# Altium project multisheet create compound.PrjPcb
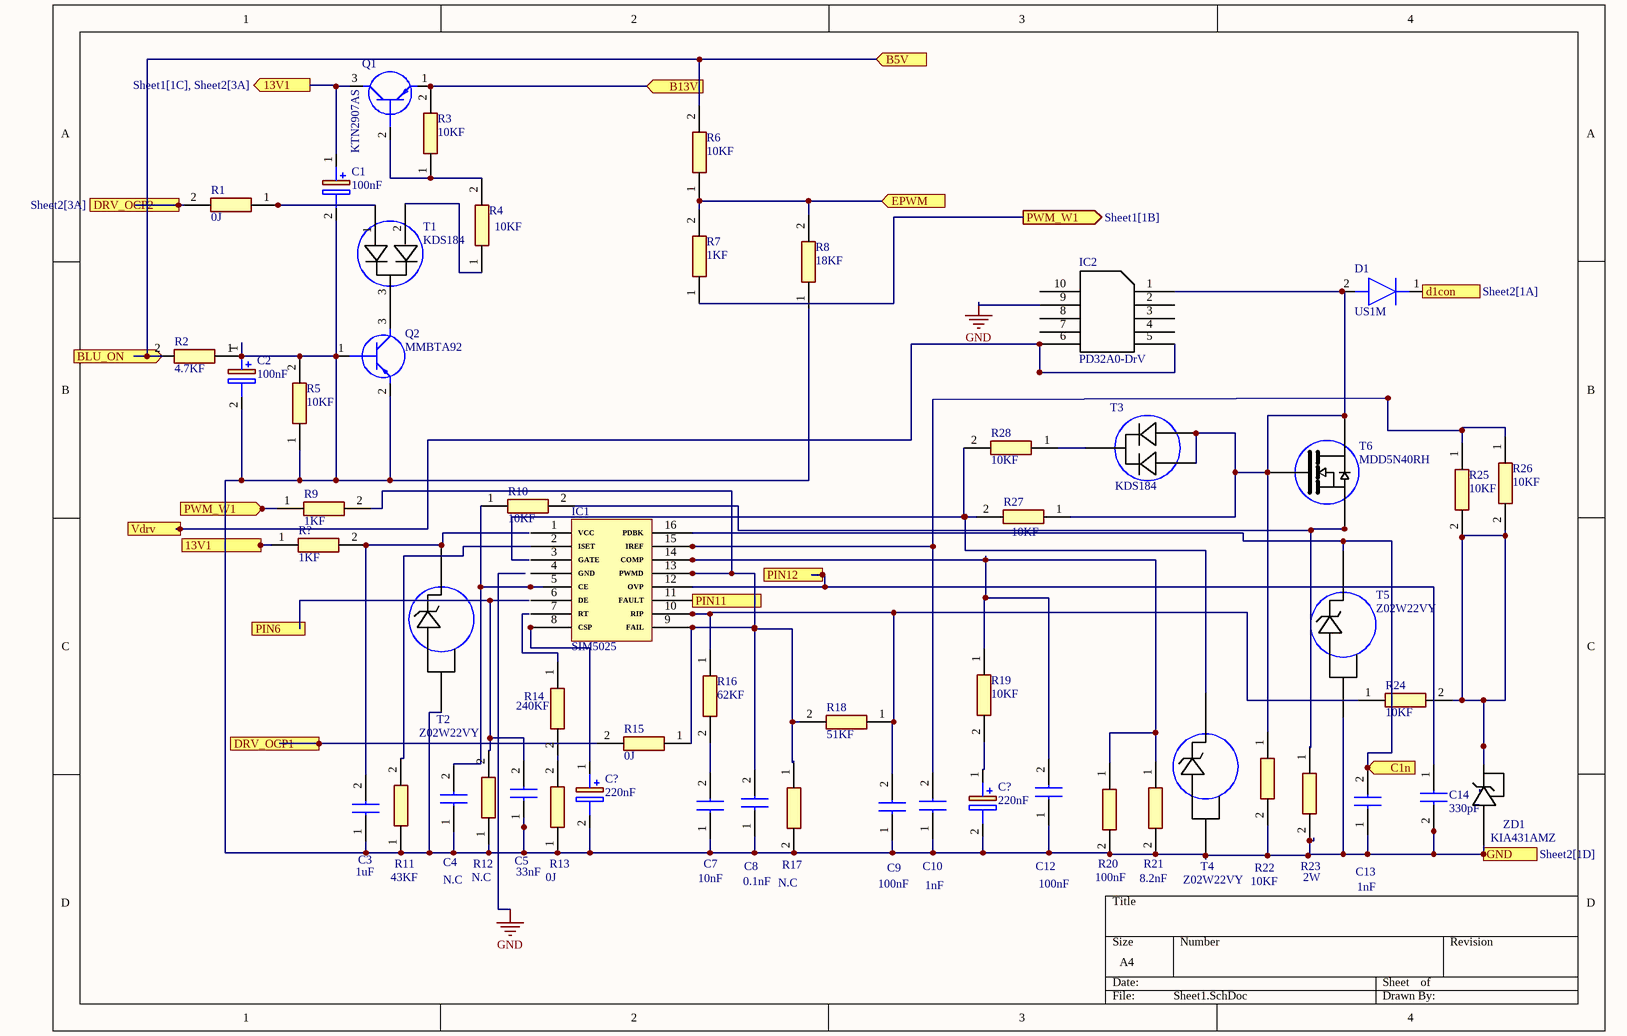
[diagram p0: Sheet1.SchDoc]
4 sheets, 174 parts. Net scope: flat (ports and power ports of the same name join across sheets).
Board file: PCB1.PcbDoc
Sheets:
  Sheet1.SchDoc
  Sheet2.SchDoc
  Sheet3.SchDoc
  Sheet4.SchDoc

## Sheet Sheet1.SchDoc
size A4; SheetNumber: 1; SheetTotal: 2

### Parts
(Parts that share a designator on the sheet are numbered #1, #2 ... from top to bottom, then left to right.)
C1  100nF  [CAPPRD150W50D400H600]
C2  100nF  [CAPPRD150W50D400H600]
C3  1uF  [CAPPRD200W55D525H1200]
C4  N.C  [CAPPRD200W55D525H1200]
C5  33nF  [CAPPRD200W55D525H1200]
C7  10nF  [CAPPRD200W55D525H1200]
C8  0.1nF  [CAPPRD200W55D525H1200]
C9  100nF  [CAPPRD200W55D525H1200]
C10  1nF  [CAPPRD200W55D525H1200]
C12  100nF  [CAPPRD200W55D525H1200]
C13  1nF  [CAPPRD200W55D525H1200]
C14  330pF  [FA18]
C?#1  220nF  [CAPPRD200W55D500H1250]
C?#2  220nF  [CAPPRD200W55D500H1250]
D1  US1M  [DIOM5127X229N]
IC1  SIM5025
IC2  PD32A0-DrV
Q1  KTN2907AS  [SOT95P245X130-3N]
Q2  MMBTA92  [SOT95P245X130-3N]
R1  0J  [RESAD1170W45L370D200]
R2  4.7KF  [RESAD1170W45L370D200]
R3  10KF  [RESAD1170W45L370D200]
R4  10KF  [RESAD1170W45L370D200]
R5  10KF  [RESAD1170W45L370D200]
R6  10KF  [RESAD1170W45L370D200]
R7  1KF  [RESAD1170W45L370D200]
R8  18KF  [RESAD1170W45L370D200]
R9  1KF  [RESAD1170W45L370D200]
R10  10KF  [RESAD1170W45L370D200]
R11  43KF  [RESAD1170W45L370D200]
R12  N.C  [RESAD1170W45L370D200]
R13  0J  [RESAD1170W45L370D200]
R14  240KF  [RESAD1170W45L370D200]
R15  0J  [RESAD1170W45L370D200]
R16  62KF  [RESAD1170W45L370D200]
R17  N.C  [RESAD1170W45L370D200]
R18  51KF  [RESAD1170W45L370D200]
R19  10KF  [RESAD1170W45L370D200]
R20  100nF  [RESAD1170W45L370D200]
R21  8.2nF  [RESAD1170W45L370D200]
R22  10KF  [RESAD1170W45L370D200]
R23  2W  [RESAD1170W45L370D200]
R24  10KF  [RESAD1170W45L370D200]
R25  10KF  [RESAD1170W45L370D200]
R26  10KF  [RESAD1170W45L370D200]
R27  10KF  [RESAD1170W45L370D200]
R28  10KF  [RESAD1170W45L370D200]
R?  1KF  [RESAD1170W45L370D200]
T1  KDS184
T2  Z02W22VY
T3  KDS184
T4  Z02W22VY
T5  Z02W22VY
T6  MDD5N40RH
ZD1  KIA431AMZ

### Ports
13V1 (in, see Sheet1[1A], Sheet2[3A]), 13V1 (out, see Sheet1[1C], Sheet2[3A]), B5V (in), B13V (in), BLU_ON (in), C1n (in, see Sheet2[2C]), d1con (in, see Sheet2[1A]), DRV_OCP1 (out), DRV_OCP2 (in, see Sheet2[3A]), EPWM (in), GND (in, see Sheet2[1D]), PIN6 (in, see Sheet2[3D]), PIN11 (in, see Sheet2[2C]), PIN12 (in, see Sheet2[1C]), PWM_W1 (in, see Sheet1[3A]), PWM_W1 (out, see Sheet1[1B]), Vdrv (in)

### Nets
GND: C1.2(-) C2.1(+) C2.2(-) C3.1(+) C4.1(+) C5.1(+) C7.1(+) C8.1(+) C9.1(+) C10.1(+) C12.1(+) C13.1(+) C14.2 C?#1.2(-) C?#2.2(-) IC2.9 Q2.1(B) Q2.2(E) R2.1 R5.1 R5.2 R8.1 R11.1 R12.1 R13.1 R17.2 R20.2 R21.2 R22.2 R23.2 T2.2 T4.2 T5.2 ZD1.66 ; port GND
NetC1_1: C1.1(+) Q1.3(C) R?.1 ; port 13V1
NetC3_2: C3.2(-) R?.2 T2.1
NetC4_2: C4.2(-) IC1.5(CE) R10.1
NetC5_2: C5.2(-) R12.2
NetC7_2: C7.2(-) R16.2
NetC8_2: C8.2(-) IC1.9(FAIL) IC1.13(PWMD) R9.2 R15.1 R17.1 R18.2
NetC9_2: C9.2(-) IC1.10(RIP) R16.1 R18.1 R24.1
NetC10_2: C10.2(-) IC1.15(IREF) R25.1 R26.1
NetC12_2: C12.2(-) IC1.14(COMP) R19.1 R20.1 R21.1
NetC13_2: C13.2(-) IC1.16(PDBK) T5.1 ; port C1n
NetC14_1: C14.1 IC1.12(OVP) ; port PIN12
NetC15_2: D1.1(K) ; port d1con
NetC40_2: R2.2 R6.2 ; port BLU_ON, port B5V
NetC?#1_1: C?#1.1(+) IC1.8(CSP)
NetC?#2_1: C?#2.1(+) R19.2
NetD1_2: D1.2(A) IC2.1 R22.1 R27.1 T3.1 T3.2 T6.70 T6.72
NetD21_2: R15.2 ; port DRV_OCP1
NetD22_2: R1.2 ; port DRV_OCP2
NetIC1_2: IC1.2(ISET) R11.2
NetIC1_11: IC1.11(FAULT) ; port PIN11
NetIC2_5: IC2.5 IC2.6 ; port Vdrv
NetIC5_2: R6.1 R7.2 R8.2 ; port EPWM
NetQ1_1: Q1.1(E) R3.2 ; port B13V
NetQ1_2: Q1.2(B) R3.1 R4.2
NetQ2_3: Q2.3(C) T1.3
NetR1_1: R1.1 T1.1
NetR4_1: R4.1 T1.2
NetR7_1: R7.1 R9.1 ; port PWM_W1
NetR10_2: R10.2 R23.1 T6.71
NetR13_2: R13.2 R14.2
NetR24_2: R24.2 R25.2 R26.2 ZD1.67
NetR27_2: R27.2 R28.2 T4.1
NetR28_1: R28.1 T3.3

Not connected (* = marked no-connect by the designer): IC1 1(VCC) 3(GATE) 4(GND) 6(DE) 7(RT); IC2 2(55) 3(56) 4(57) 7(62) 8(61) 10(59); R14 1

### Library data of the parts
C1 C2 = ECEA1HKS0R1: Capacitor Polarised; Manufacturer_Name: Panasonic; Datasheet Link: https://componentsearchengine.com/Datasheets/2/ECEA1HKS0R1.pdf; Height: 6mm; Manufacturer_Part_Number: ECEA1HKS0R1
C3-C5 C7-C10 C12 C13 = ECA-1HM0R1: Capacitor; Manufacturer_Name: Panasonic; Height: 12mm; Manufacturer_Part_Number: ECA-1HM0R1; Mouser Part Number: 667-ECA-1HM0R1; Mouser Price/Stock: https://www.mouser.com/Search/Refine.aspx?Keyword=667-ECA-1HM0R1
C14 = FA18C0G1H331JNU06: Capacitor; Manufacturer_Name: TDK; Datasheet Link: https://product.tdk.com/system/files/dam/doc/product/capacitor/ceramic/lead-mlcc/catalog/leadmlcc_halogenfree_fa_en.pdf; Height: 5.5mm; Manufacturer_Part_Number: FA18C0G1H331JNU06; Mouser Part Number: 810-FA18C0G1H331JNU6; Mouser Price/Stock: https://www.mouser.com/Search/Refine.aspx?Keyword=810-FA18C0G1H331JNU6
C?#1 C?#2 = EEUHD1HR22: Capacitor Polarised; Manufacturer_Name: Panasonic; Datasheet Link: http://industrial.panasonic.com/cdbs/www-data/pdf/RDF0000/ABA0000C1035.pdf; Height: 12.5mm; Manufacturer_Part_Number: EEUHD1HR22
D1 = US1M-E3_61T: Diode; Manufacturer_Name: Vishay; Manufacturer_Part_Number: US1M-E3/61T; Datasheet Link: https://componentsearchengine.com/Datasheets/2/US1M-E3_61T.pdf; Height: 2.29mm; Mouser Part Number: 625-US1M-E3; Mouser Price/Stock: https://www.mouser.co.uk/ProductDetail/Vishay-General-Semiconductor/US1M-E3-61T?qs=D6r9GjgEnNOosWuyVR8q1A%3D%3D; Arrow Part Number: US1M-E3/61T; Arrow Price/Stock: https://www.arrow.com/en/products/us1m-e361t/vishay?region=europe
Q1 = KTN2907AS: Transistor BJT PNP; Manufacturer_Name: KEC; Datasheet Link: https://4donline.ihs.com/images/VipMasterIC/IC/KECC/KECC-S-A0011628695/KECC-S-A0011628695-1.pdf?hkey=EF798316E3902B6ED9A73243A3159BB0; Height: 1.3mm; Manufacturer_Part_Number: KTN2907AS
Q2 = MMBTA92: Transistor BJT PNP; Manufacturer_Name: KEC; Datasheet Link: https://www.alldatasheet.com/datasheet-pdf/pdf/69996/KEC/MMBTA92.html; Height: 1.3mm; Manufacturer_Part_Number: MMBTA92
R1-R28 R? = MFR3-10KFC: Resistor; Manufacturer_Name: TT Electronics; Datasheet Link: https://componentsearchengine.com/Datasheets/2/MFR3-10KFC.pdf; Manufacturer_Part_Number: MFR3-10KFC; Mouser Part Number: 756-MFR3-10KFC; Mouser Price/Stock: https://www.mouser.co.uk/ProductDetail/Welwyn-Components-TT-Electronics/MFR3-10KFC?qs=i9QNUsDsAPN%252BMi4lKUEV5Q%3D%3D; Arrow Part Number: MFR3-10KFC; Arrow Price/Stock: https://www.arrow.com/en/products/mfr3-10kfc/welwyn-components?region=europe

## Sheet Sheet2.SchDoc
size A4; SheetNumber: 2; SheetTotal: 2
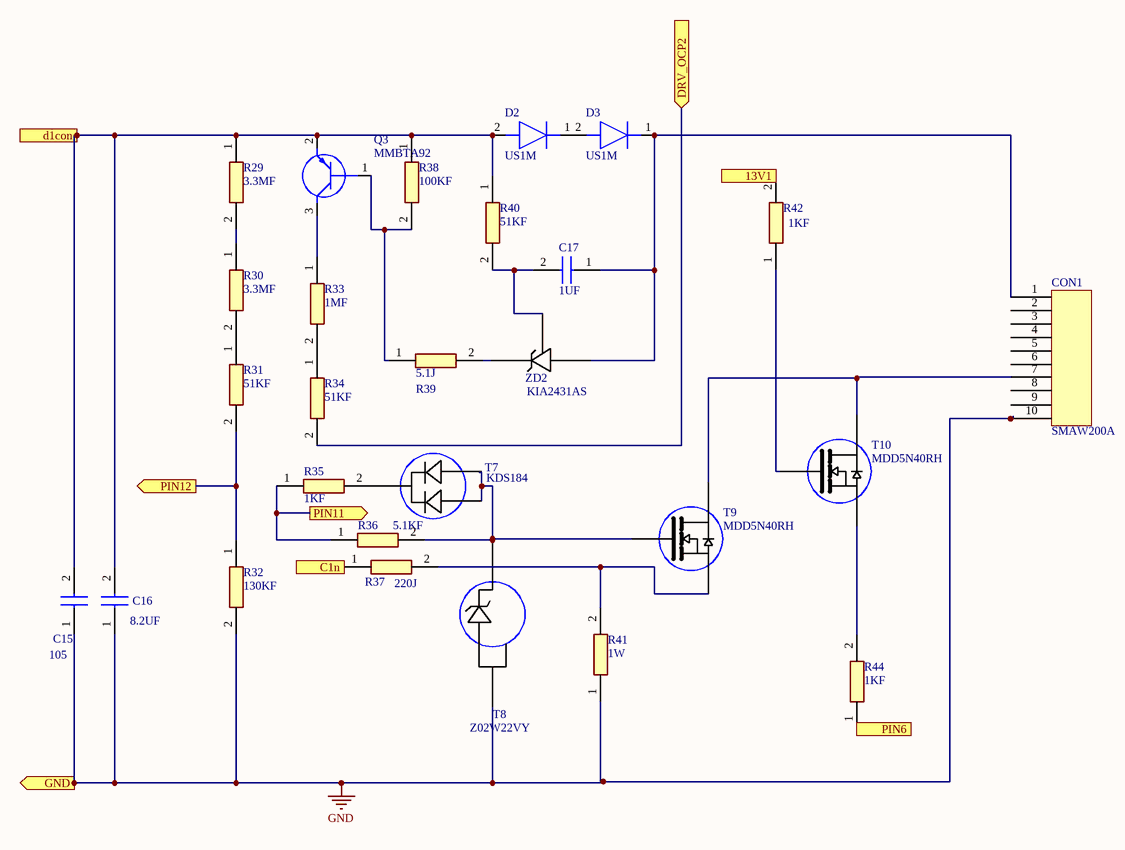
[diagram p1: Sheet2.SchDoc]

### Parts
C15  105  [CAPPRD200W55D525H1200]
C16  8.2UF  [CAPPRD200W55D525H1200]
C17  1UF  [CAPPRD200W55D525H1200]
CON1  SMAW200A  [SMAW200A]
D2  US1M  [DIOM5127X229N]
D3  US1M  [DIOM5127X229N]
Q3  MMBTA92  [SOT95P245X130-3N]
R29  3.3MF  [RESAD1170W45L370D200]
R30  3.3MF  [RESAD1170W45L370D200]
R31  51KF  [RESAD1170W45L370D200]
R32  130KF  [RESAD1170W45L370D200]
R33  1MF  [RESAD1170W45L370D200]
R34  51KF  [RESAD1170W45L370D200]
R35  1KF  [RESAD1170W45L370D200]
R36  5.1KF  [RESAD1170W45L370D200]
R37  220J  [RESAD1170W45L370D200]
R38  100KF  [RESAD1170W45L370D200]
R39  5.1J  [RESAD1170W45L370D200]
R40  51KF  [RESAD1170W45L370D200]
R41  1W  [RESAD1170W45L370D200]
R42  1KF  [RESAD1170W45L370D200]
R44  1KF  [RESAD1170W45L370D200]
T7  KDS184
T8  Z02W22VY
T9  MDD5N40RH
T10  MDD5N40RH
ZD2  KIA2431AS  [KIA2431AS]

### Ports
13V1 (in, see Sheet1[1A], Sheet1[1C]), C1n (out, see Sheet1[4C]), d1con (out, see Sheet1[4B]), DRV_OCP2 (in, see Sheet1[1A]), GND (out, see Sheet1[4D]), PIN6 (out, see Sheet1[1C]), PIN11 (out, see Sheet1[2C]), PIN12 (out, see Sheet1[2C])

### Nets
GND: C15.1(+) C16.1(+) CON1.10 R32.2 R41.1 T8.2 ; port GND
NetC1_1: R42.2 ; port 13V1
NetC13_2: R37.1 ; port C1n
NetC14_1: R31.2 R32.1 ; port PIN12
NetC15_2: C15.2(-) C16.2(-) D2.2(A) Q3.2(E) R29.1 R38.1 R40.1 ; port d1con
NetC17_1: C17.1(+) CON1.1 D3.1(K) ZD2.2
NetC17_2: C17.2(-) R40.2 ZD2.3
NetCON1_7: CON1.7 T9.70 T10.70
NetD2_1: D2.1(K) D3.2(A)
NetD22_2: R34.2 ; port DRV_OCP2
NetIC1_11: R35.1 R36.1 ; port PIN11
NetQ3_1: Q3.1(B) R38.2 R39.1
NetQ3_3: Q3.3(C) R33.1
NetR29_2: R29.2 R30.1
NetR30_2: R30.2 R31.1
NetR33_2: R33.2 R34.1
NetR35_2: R35.2 T7.3
NetR36_2: R36.2 T7.2 T8.1 T9.72
NetR37_2: R37.2 R41.2 T9.71
NetR39_2: R39.2 ZD2.1
NetR42_1: R42.1 T10.72
NetR44_1: R44.1 ; port PIN6
NetR44_2: R44.2 T10.71

Not connected (* = marked no-connect by the designer): CON1 2(70) 3(71) 4(72) 5(73) 6(74) 8(76) 9(77); T7 1(25)

### Library data of the parts
C15-C17 = ECA-1HM0R1: Capacitor; Manufacturer_Name: Panasonic; Height: 12mm; Manufacturer_Part_Number: ECA-1HM0R1; Mouser Part Number: 667-ECA-1HM0R1; Mouser Price/Stock: https://www.mouser.com/Search/Refine.aspx?Keyword=667-ECA-1HM0R1
D2 D3 = US1M-E3_61T: as D1 on sheet Sheet1; Datasheet Link: https://componentsearchengine.com/Datasheets/2/US1M-E3_61T.pdf; Height: 2.29mm; Mouser Part Number: 625-US1M-E3; Mouser Price/Stock: https://www.mouser.co.uk/ProductDetail/Vishay-General-Semiconductor/US1M-E3-61T?qs=D6r9GjgEnNOosWuyVR8q1A%3D%3D; Arrow Part Number: US1M-E3/61T; Arrow Price/Stock: https://www.arrow.com/en/products/us1m-e361t/vishay?region=europe
Q3 = MMBTA92: as Q2 on sheet Sheet1; Datasheet Link: https://www.alldatasheet.com/datasheet-pdf/pdf/69996/KEC/MMBTA92.html; Height: 1.3mm; Manufacturer_Part_Number: MMBTA92
R29-R42 R44 = MFR3-10KFC: as R1 on sheet Sheet1; Datasheet Link: https://componentsearchengine.com/Datasheets/2/MFR3-10KFC.pdf; Manufacturer_Part_Number: MFR3-10KFC; Mouser Part Number: 756-MFR3-10KFC; Mouser Price/Stock: https://www.mouser.co.uk/ProductDetail/Welwyn-Components-TT-Electronics/MFR3-10KFC?qs=i9QNUsDsAPN%252BMi4lKUEV5Q%3D%3D; Arrow Part Number: MFR3-10KFC; Arrow Price/Stock: https://www.arrow.com/en/products/mfr3-10kfc/welwyn-components?region=europe

## Sheet Sheet3.SchDoc
size A4; SheetNumber: 3; SheetTotal: 3
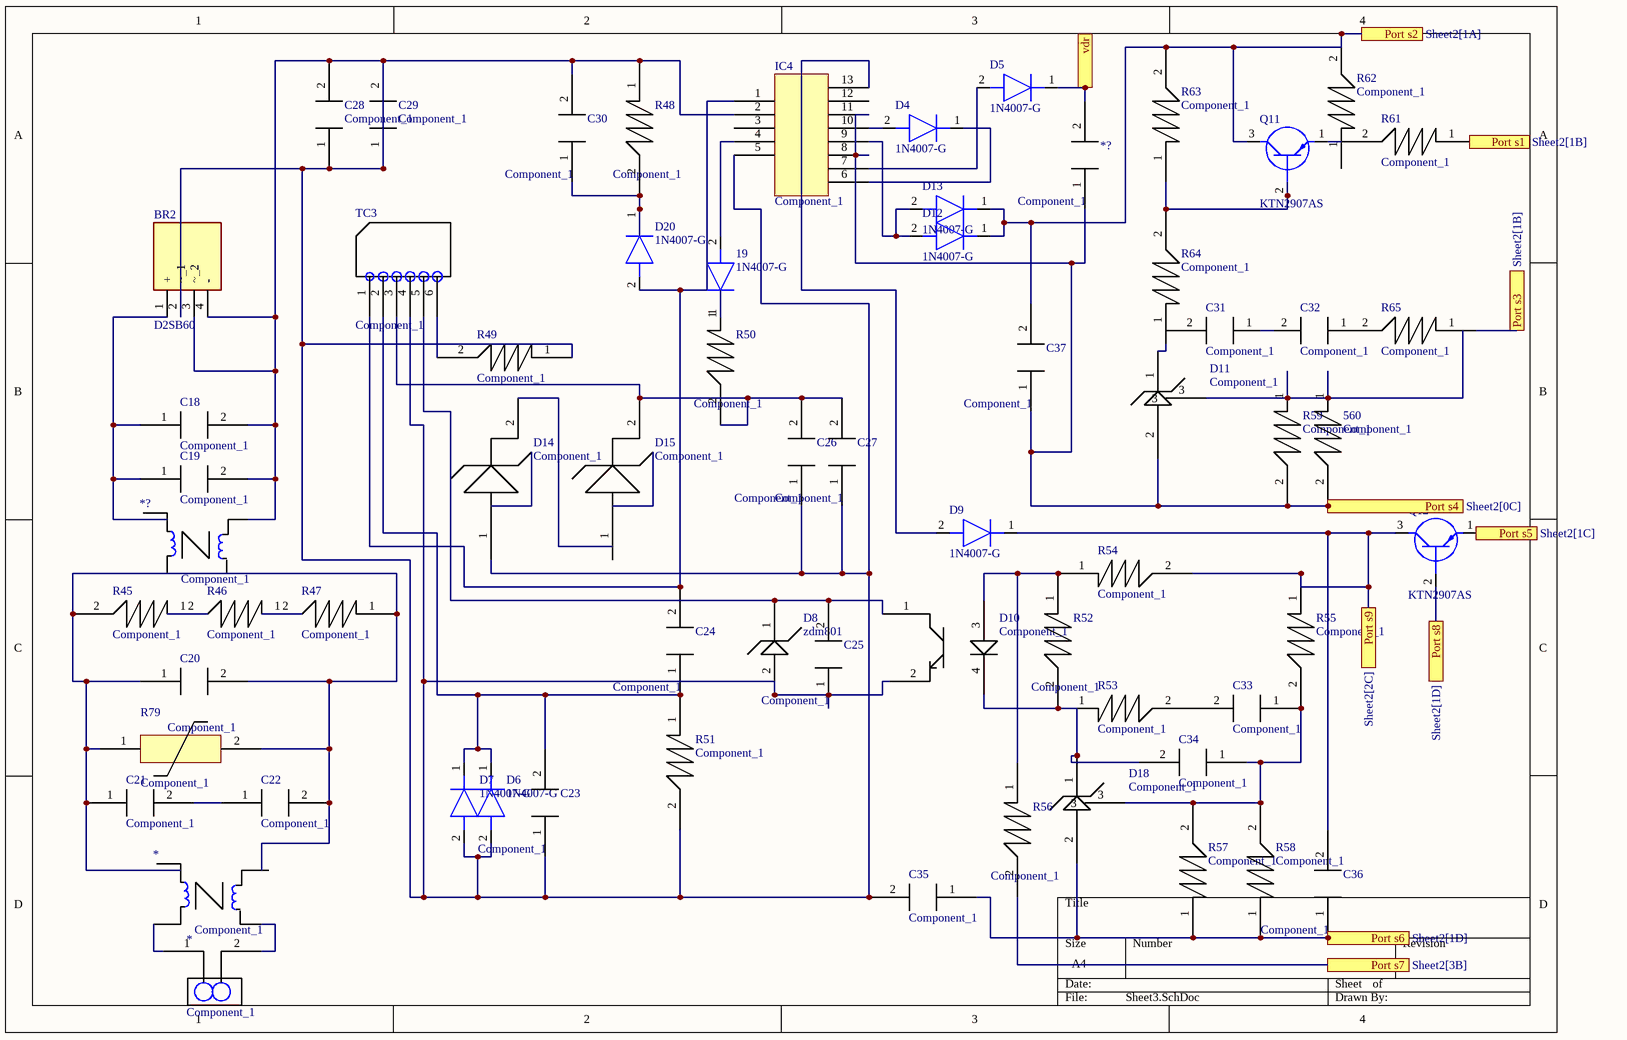
[diagram p2: Sheet3.SchDoc]

### Parts
(Parts that share a designator on the sheet are numbered #1, #2 ... from top to bottom, then left to right.)
19  1N4007-G  [DIOAD1410W90L470D235]
560  Component_1  [PCBComponent_1]
*#1  Component_1  [PCBComponent_1]
*#2  Component_1  [PCBComponent_1]
*?#1  Component_1  [PCBComponent_1]
*?#2  Component_1  [PCBComponent_1]
BR2  D2SB60  [D2SB60]
C18  Component_1  [PCBComponent_1]
C19  Component_1  [PCBComponent_1]
C20  Component_1  [PCBComponent_1]
C21  Component_1  [PCBComponent_1]
C22  Component_1  [PCBComponent_1]
C23  Component_1  [PCBComponent_1]
C24  Component_1  [PCBComponent_1]
C25  Component_1  [PCBComponent_1]
C26  Component_1  [PCBComponent_1]
C27  Component_1  [PCBComponent_1]
C28  Component_1  [PCBComponent_1]
C29  Component_1  [PCBComponent_1]
C30  Component_1  [PCBComponent_1]
C31  Component_1  [PCBComponent_1]
C32  Component_1  [PCBComponent_1]
C33  Component_1  [PCBComponent_1]
C34  Component_1  [PCBComponent_1]
C35  Component_1  [PCBComponent_1]
C36  Component_1  [PCBComponent_1]
C37  Component_1  [PCBComponent_1]
D4  1N4007-G  [DIOAD1410W90L470D235]
D5  1N4007-G  [DIOAD1410W90L470D235]
D6  1N4007-G  [DIOAD1410W90L470D235]
D7  1N4007-G  [DIOAD1410W90L470D235]
D8  zdm801  [PCBComponent_1]
D9  1N4007-G  [DIOAD1410W90L470D235]
D10  Component_1  [PCBComponent_1]
D11  Component_1  [PCBComponent_1]
D12  1N4007-G  [DIOAD1410W90L470D235]
D13  1N4007-G  [DIOAD1410W90L470D235]
D14  Component_1
D15  Component_1
D18#1  Component_1  [PCBComponent_1]
D20  1N4007-G  [DIOAD1410W90L470D235]
IC4  Component_1  [PCBComponent_1]
Q11  KTN2907AS  [SOT95P245X130-3N]
Q12  KTN2907AS  [SOT95P245X130-3N]
R45  Component_1  [PCBComponent_1]
R46  Component_1  [PCBComponent_1]
R47  Component_1  [PCBComponent_1]
R48  Component_1  [PCBComponent_1]
R49  Component_1  [PCBComponent_1]
R50  Component_1  [PCBComponent_1]
R51  Component_1  [PCBComponent_1]
R52  Component_1  [PCBComponent_1]
R53  Component_1  [PCBComponent_1]
R54  Component_1  [PCBComponent_1]
R55  Component_1  [PCBComponent_1]
R56  Component_1  [PCBComponent_1]
R57  Component_1  [PCBComponent_1]
R58  Component_1  [PCBComponent_1]
R59  Component_1  [PCBComponent_1]
R61  Component_1  [PCBComponent_1]
R62  Component_1  [PCBComponent_1]
R63  Component_1  [PCBComponent_1]
R64  Component_1  [PCBComponent_1]
R65  Component_1  [PCBComponent_1]
R79  Component_1
TC3  Component_1  [PCBComponent_1]

### Ports
Port s1 (see Sheet2[1B]), Port s2 (see Sheet2[1A]), Port s3 (see Sheet2[1B]), Port s4 (see Sheet2[0C]), Port s5 (see Sheet2[1C]), Port s6 (see Sheet2[1D]), Port s7 (see Sheet2[3B]), Port s8 (see Sheet2[1D]), Port s9 (see Sheet2[2C]), vdr

### Nets
Net19_1: 19.1(K) R50.1
Net19_2: 19.2(A) IC4.4
Net560_1: 560.1 D11.3 R59.1
Net560_2: 560.2 *?#1.1 C35.1 C36.1 C36.2 C37.1 D9.1(K) D11.2 D18#1.2 IC4.8 IC4.11 Q12.3(C) R54.2 R55.1 R57.1 R58.1 R59.2 ; port Port s4, port Port s6, port Port s9
Net*?#1_2: *?#1.2 D5.1(K) ; port vdr
Net*?#3_1: R65.1 ; port Port s3
NetBR2_1: BR2.1(+) C18.1 C19.1
NetBR2_2: BR2.2(~_1) BR2.3(~_2) BR2.4(-) C18.2 C19.2 C23.1 C25.1 C26.1 C27.1 C28.1 C28.2 C29.1 C29.2 C30.2 C35.2 D6.2(A) D7.2(A) D8.2 D10.2 D14.1 IC4.2 IC4.5 R48.1 R49.1 R51.2 TC3.4
NetC20_1: C20.1 C20.2 C21.1 C22.2 R45.2 R47.1 R79.1 R79.2
NetC21_2: C21.2 C22.1
NetC23_2: C23.2 C24.1 D6.1(K) D7.1(K) R51.1 TC3.2
NetC24_2: C24.2 D20.2(A) IC4.1 TC3.1
NetC25_2: C25.2 D8.1 D10.1 TC3.5
NetC26_2: C26.2 C27.2 D15.2 R50.2 TC3.3
NetC30_1: C30.1 D20.1(K) R48.2
NetC31_1: C31.1 C32.2
NetC33_1: C33.1 C34.1 D18#1.3 R55.2 R57.2 R58.2
NetC33_2: C33.2 R53.2
NetC34_2: C34.2 D10.4 D18#1.1 R52.2 R53.1
NetC37_2: C37.2 D12.1(K) D13.1(K) Q11.3(C) R62.2 R63.2 ; port Port s2
NetC40_2: Q12.1(E) ; port Port s5
NetD4_1: D4.1(K) IC4.6
NetD4_2: D4.2(A) IC4.10
NetD5_2: D5.2(A) IC4.7
NetD9_2: D9.2(A) IC4.13
NetD10_3: D10.3 R52.1 R54.1 R56.1
NetD11_1: D11.1 R64.1
NetD12_2: D12.2(A) D13.2(A) IC4.9
NetD18#2_2: Q12.2(B) ; port Port s8
NetQ11_1: Q11.1(E) R61.2
NetQ11_2: Q11.2(B) R63.1 R64.2
NetQ15_1: R56.2 ; port Port s7
NetR45_1: R45.1 R46.2
NetR46_1: R46.1 R47.2
NetR49_2: R49.2 TC3.6

Not connected (* = marked no-connect by the designer): *#1 1 2; C31 2; C32 1; D14 2; D15 1; IC4 3 12; R61 1; R62 1; R65 2

### Library data of the parts
19 D4-D7 D9 D12 D13 D20 = 1N4007-G: Diode; Manufacturer_Name: Comchip Technology; Datasheet Link: https://datasheet.datasheetarchive.com/originals/distributors/Datasheets-DGA23/1390217.pdf; Manufacturer_Part_Number: 1N4007-G; Mouser Part Number: 750-1N4007-G; Mouser Price/Stock: https://www.mouser.co.uk/ProductDetail/Comchip-Technology/1N4007-G?qs=2qJf6qQ4IOKzApuByvlhjQ%3D%3D; Arrow Part Number: 1N4007-G; Arrow Price/Stock: https://www.arrow.com/en/products/1n4007-g/comchip-technology?region=nac
BR2 = D2SB60: Bridge Rectifier; Manufacturer_Name: Taiwan Semiconductor; Datasheet Link: https://www.taiwansemi.com/assets/uploads/datasheet/D2SB05%20SERIES_K2103.pdf; Height: 11.3mm; Manufacturer_Part_Number: D2SB60; Mouser Part Number: 821-D2SB60; Mouser Price/Stock: https://www.mouser.com/Search/Refine.aspx?Keyword=821-D2SB60
Q11 Q12 = KTN2907AS: as Q1 on sheet Sheet1; Datasheet Link: https://4donline.ihs.com/images/VipMasterIC/IC/KECC/KECC-S-A0011628695/KECC-S-A0011628695-1.pdf?hkey=EF798316E3902B6ED9A73243A3159BB0; Height: 1.3mm; Manufacturer_Part_Number: KTN2907AS

## Sheet Sheet4.SchDoc
size A4; SheetNumber: 4; SheetTotal: 4
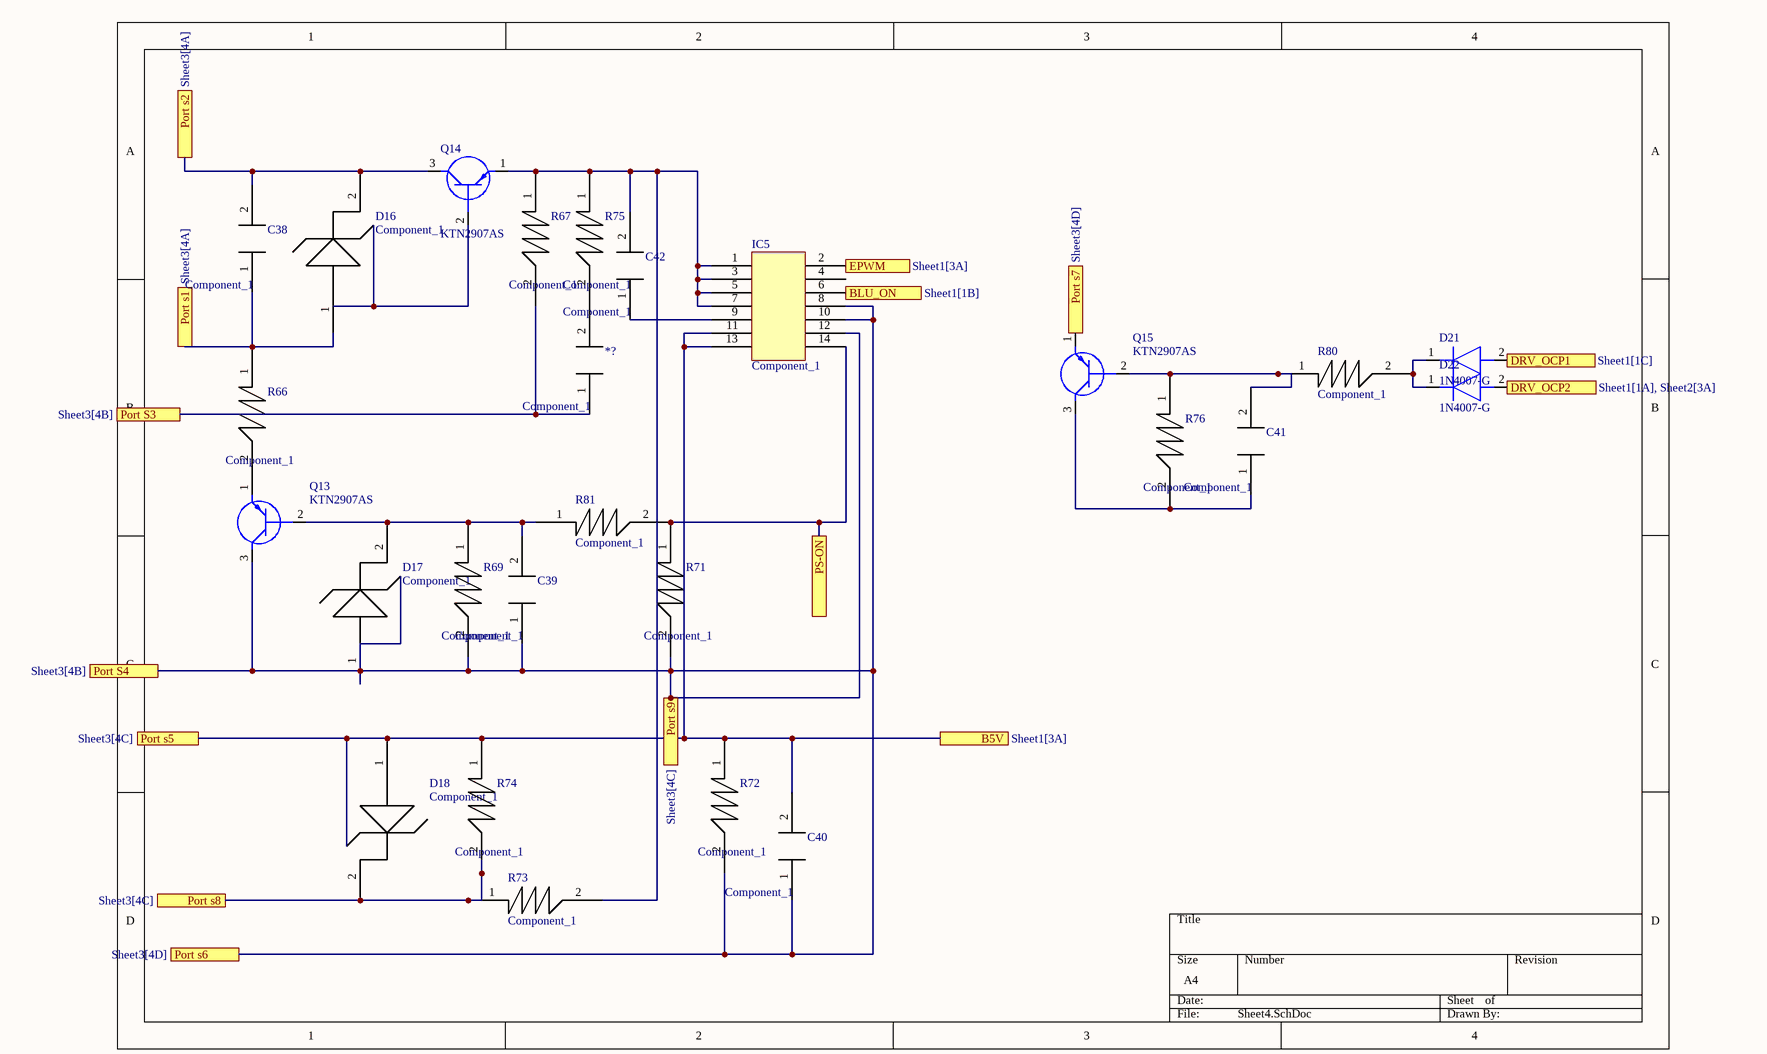
[diagram p3: Sheet4.SchDoc]

### Parts
(Parts that share a designator on the sheet are numbered #1, #2 ... from top to bottom, then left to right.)
*?#3  Component_1  [PCBComponent_1]
C38  Component_1  [PCBComponent_1]
C39  Component_1  [PCBComponent_1]
C40  Component_1  [PCBComponent_1]
C41  Component_1  [PCBComponent_1]
C42  Component_1  [PCBComponent_1]
D16  Component_1
D17  Component_1
D18#2  Component_1
D21  1N4007-G  [DIOAD1410W90L470D235]
D22  1N4007-G  [DIOAD1410W90L470D235]
IC5  Component_1  [PCBComponent_1]
Q13  KTN2907AS  [SOT95P245X130-3N]
Q14  KTN2907AS  [SOT95P245X130-3N]
Q15  KTN2907AS  [SOT95P245X130-3N]
R66  Component_1  [PCBComponent_1]
R67  Component_1  [PCBComponent_1]
R69  Component_1  [PCBComponent_1]
R71  Component_1  [PCBComponent_1]
R72  Component_1  [PCBComponent_1]
R73  Component_1  [PCBComponent_1]
R74  Component_1  [PCBComponent_1]
R75  Component_1  [PCBComponent_1]
R76  Component_1  [PCBComponent_1]
R80  Component_1  [PCBComponent_1]
R81  Component_1  [PCBComponent_1]

### Ports
B5V (see Sheet1[3A]), BLU_ON (see Sheet1[1B]), DRV_OCP1 (see Sheet1[1C]), DRV_OCP2 (see Sheet1[1A], Sheet2[3A]), EPWM (see Sheet1[3A]), Port s1 (see Sheet3[4A]), Port s2 (see Sheet3[4A]), Port S3 (see Sheet3[4B]), Port S4 (see Sheet3[4B]), Port s5 (see Sheet3[4C]), Port s6 (see Sheet3[4D]), Port s7 (see Sheet3[4D]), Port s8 (see Sheet3[4C]), Port s9 (see Sheet3[4C]), PS-ON

### Nets
Net560_2: C39.1 C40.1 D17.1 IC5.8 IC5.10 IC5.12 Q13.3(C) R69.2 R71.2 R72.2 ; port Port S4, port Port s9, port Port s6
Net*?#3_1: *?#3.1 R67.2 ; port Port S3
Net*?#3_2: *?#3.2 R75.2
NetC37_2: C38.2 D16.2 Q14.3(C) ; port Port s2
NetC38_1: C38.1 D16.1 R66.1 ; port Port s1
NetC39_2: C39.2 D17.2 Q13.2(B) R69.1 R81.1
NetC40_2: C40.2 D18#2.1 IC5.6 IC5.11 IC5.13 R72.1 R74.1 ; port Port s5, port B5V, port BLU_ON
NetC41_1: C41.1 Q15.3(C) R76.2
NetC41_2: C41.2 Q15.2(B) R76.1 R80.1
NetC42_1: C42.1 IC5.9
NetC42_2: C42.2 IC5.1 IC5.3 IC5.5 IC5.7 Q14.1(E) R67.1 R73.2 R75.1
NetD18#2_2: D18#2.2 R73.1 R74.2 ; port Port s8
NetD21_1: D21.1(K) D22.1(K) R80.2
NetD21_2: D21.2(A) ; port DRV_OCP1
NetD22_2: D22.2(A) ; port DRV_OCP2
NetIC5_2: IC5.2 ; port EPWM
NetIC5_14: IC5.14 R71.1 R81.2 ; port PS-ON
NetQ13_1: Q13.1(E) R66.2
NetQ15_1: Q15.1(E) ; port Port s7

Not connected (* = marked no-connect by the designer): IC5 4; Q14 2(B)

### Library data of the parts
D21 D22 = 1N4007-G: as 19 on sheet Sheet3; Datasheet Link: https://datasheet.datasheetarchive.com/originals/distributors/Datasheets-DGA23/1390217.pdf; Manufacturer_Part_Number: 1N4007-G; Mouser Part Number: 750-1N4007-G; Mouser Price/Stock: https://www.mouser.co.uk/ProductDetail/Comchip-Technology/1N4007-G?qs=2qJf6qQ4IOKzApuByvlhjQ%3D%3D; Arrow Part Number: 1N4007-G; Arrow Price/Stock: https://www.arrow.com/en/products/1n4007-g/comchip-technology?region=nac
Q13-Q15 = KTN2907AS: as Q1 on sheet Sheet1; Datasheet Link: https://4donline.ihs.com/images/VipMasterIC/IC/KECC/KECC-S-A0011628695/KECC-S-A0011628695-1.pdf?hkey=EF798316E3902B6ED9A73243A3159BB0; Height: 1.3mm; Manufacturer_Part_Number: KTN2907AS

## Nets that join several sheets
GND: Sheet1 (34 pins), Sheet2 (6 pins)
Net560_2: Sheet3 (17 pins), Sheet4 (10 pins)
Net*?#3_1: Sheet3 (R65.1), Sheet4 (*?#3.1 R67.2)
NetC1_1: Sheet1 (C1.1 Q1.3 R?.1), Sheet2 (R42.2)
NetC13_2: Sheet1 (C13.2 IC1.16 T5.1), Sheet2 (R37.1)
NetC14_1: Sheet1 (C14.1 IC1.12), Sheet2 (R31.2 R32.1)
NetC15_2: Sheet1 (D1.1), Sheet2 (7 pins)
NetC37_2: Sheet3 (6 pins), Sheet4 (C38.2 D16.2 Q14.3)
NetC40_2: Sheet1 (R2.2 R6.2), Sheet3 (Q12.1), Sheet4 (7 pins)
NetD18#2_2: Sheet3 (Q12.2), Sheet4 (D18#2.2 R73.1 R74.2)
NetD21_2: Sheet1 (R15.2), Sheet4 (D21.2)
NetD22_2: Sheet1 (R1.2), Sheet2 (R34.2), Sheet4 (D22.2)
NetIC1_11: Sheet1 (IC1.11), Sheet2 (R35.1 R36.1)
NetIC5_2: Sheet1 (R6.1 R7.2 R8.2), Sheet4 (IC5.2)
NetQ15_1: Sheet3 (R56.2), Sheet4 (Q15.1)